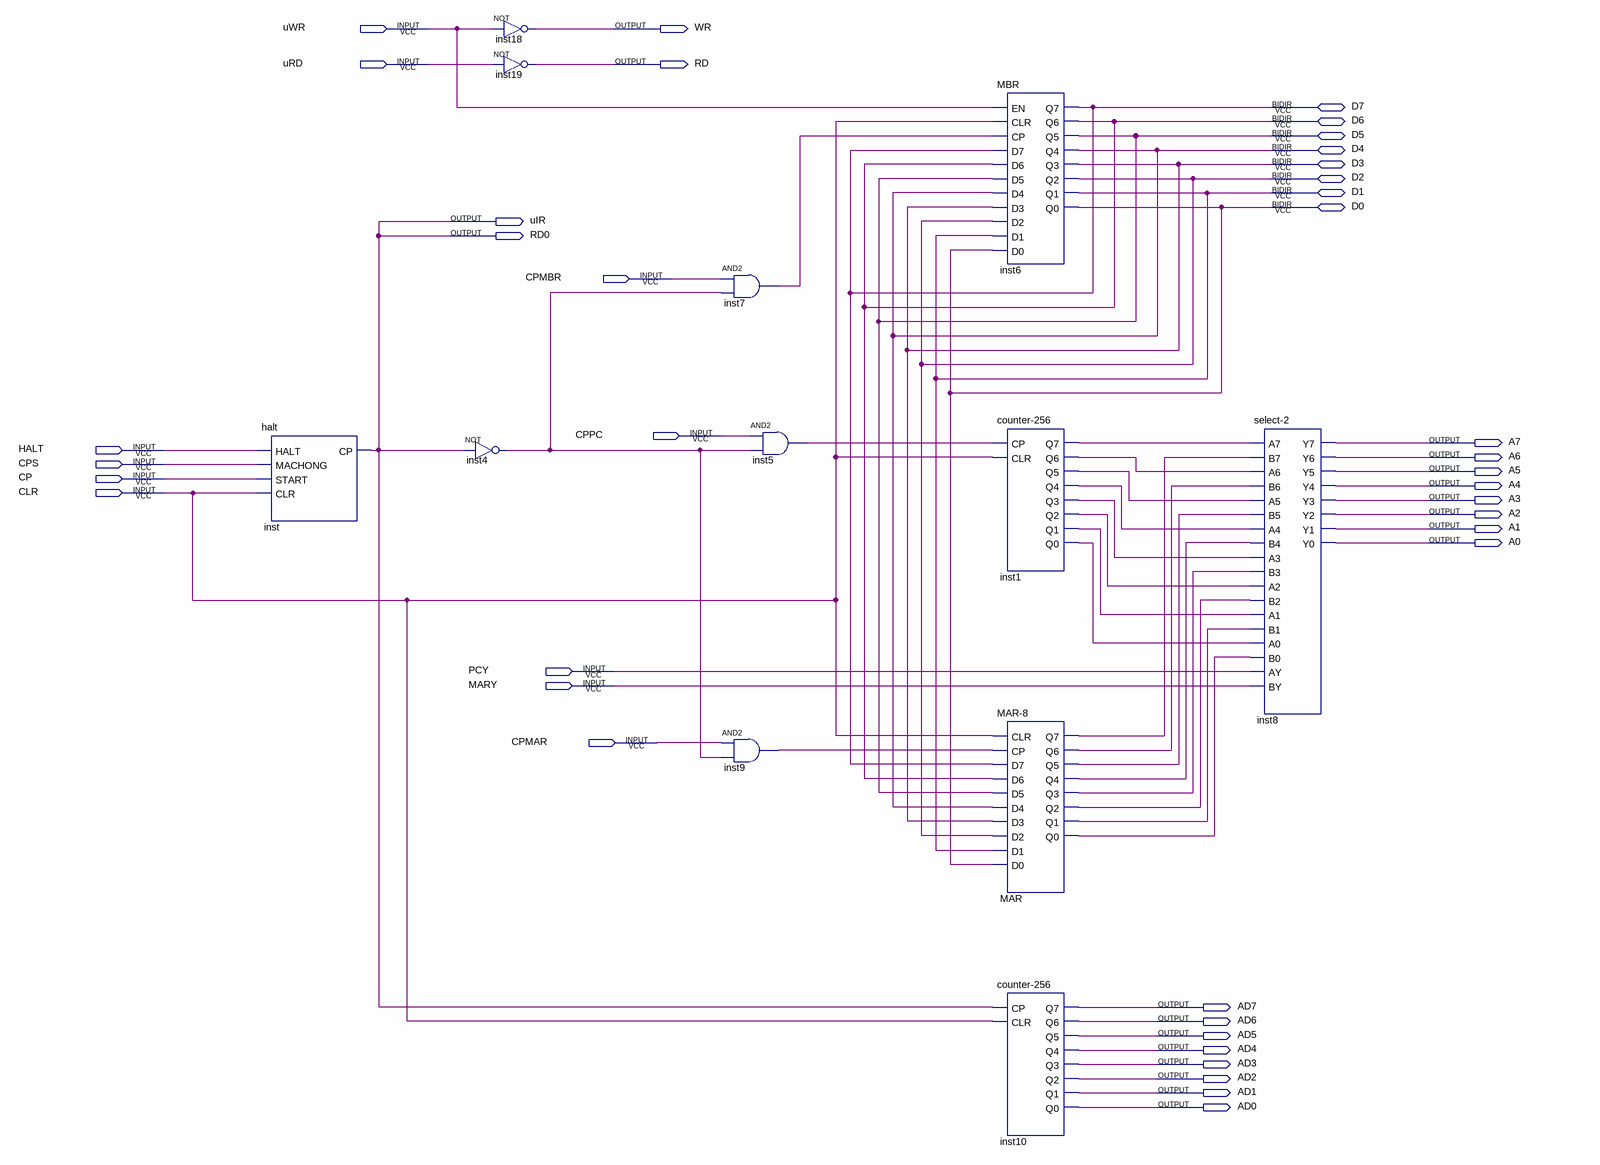
[diagram p0: schematic sheet]
// Quartus schematic ACC-MEMORY.bdf as structural Verilog: 12 symbols, 39 pins
module \ACC-MEMORY  (
  input  uWR,
  input  uRD,
  input  CPMBR,
  input  CPPC,
  input  HALT,
  input  CPS,
  input  CP,
  input  CLR,
  input  PCY,
  input  MARY,
  input  CPMAR,
  inout  D7,
  inout  D6,
  inout  D5,
  inout  D4,
  inout  D3,
  inout  D2,
  inout  D1,
  inout  D0,
  output WR,
  output RD,
  output uIR,
  output RD0,
  output A7,
  output A6,
  output A5,
  output A4,
  output A3,
  output A2,
  output A1,
  output A0,
  output AD7,
  output AD6,
  output AD5,
  output AD4,
  output AD3,
  output AD2,
  output AD1,
  output AD0
);

  wire inst1_q0, inst1_q1, inst1_q2, inst1_q3, inst1_q4, inst1_q5, inst1_q6, inst1_q7, inst4_out, inst5_out,
       inst7_out, inst9_out, MAR_q0, MAR_q1, MAR_q2, MAR_q3, MAR_q4, MAR_q5, MAR_q6, MAR_q7;

  halt inst (.HALT(HALT), .MACHONG(CPS), .START(CP), .CLR(CLR), .CP(RD0));
  not inst4 (inst4_out, RD0);
  not inst18 (WR, uWR);
  not inst19 (RD, uRD);
  and inst7 (inst7_out, CPMBR, inst4_out);
  and inst5 (inst5_out, CPPC, inst4_out);
  and inst9 (inst9_out, CPMAR, inst4_out);
  MBR inst6 (
    .EN(uWR), .CLR(CLR), .CP(inst7_out), .D7(D7), .D6(D6), .D5(D5), .D4(D4), .D3(D3), .D2(D2), .D1(D1),
    .D0(D0), .Q7(D7), .Q6(D6), .Q5(D5), .Q4(D4), .Q3(D3), .Q2(D2), .Q1(D1), .Q0(D0));
  \counter-256  inst1 (
    .CP(inst5_out), .CLR(CLR), .Q7(inst1_q7), .Q6(inst1_q6), .Q5(inst1_q5), .Q4(inst1_q4), .Q3(inst1_q3),
    .Q2(inst1_q2), .Q1(inst1_q1), .Q0(inst1_q0));
  \MAR-8  MAR (
    .CLR(CLR), .CP(inst9_out), .D7(D7), .D6(D6), .D5(D5), .D4(D4), .D3(D3), .D2(D2), .D1(D1), .D0(D0),
    .Q7(MAR_q7), .Q6(MAR_q6), .Q5(MAR_q5), .Q4(MAR_q4), .Q3(MAR_q3), .Q2(MAR_q2), .Q1(MAR_q1), .Q0(MAR_q0));
  \counter-256  inst10 (
    .CP(RD0), .CLR(CLR), .Q7(AD7), .Q6(AD6), .Q5(AD5), .Q4(AD4), .Q3(AD3), .Q2(AD2), .Q1(AD1), .Q0(AD0));
  \select-2  inst8 (
    .A7(inst1_q7), .B7(MAR_q7), .A6(inst1_q6), .B6(MAR_q6), .A5(inst1_q5), .B5(MAR_q5), .A4(inst1_q4),
    .B4(MAR_q4), .A3(inst1_q3), .B3(MAR_q3), .A2(inst1_q2), .B2(MAR_q2), .A1(inst1_q1), .B1(MAR_q1),
    .A0(inst1_q0), .B0(MAR_q0), .AY(PCY), .BY(MARY), .Y7(A7), .Y6(A6), .Y5(A5), .Y4(A4), .Y3(A3), .Y2(A2),
    .Y1(A1), .Y0(A0));

  assign uIR = RD0;
endmodule
